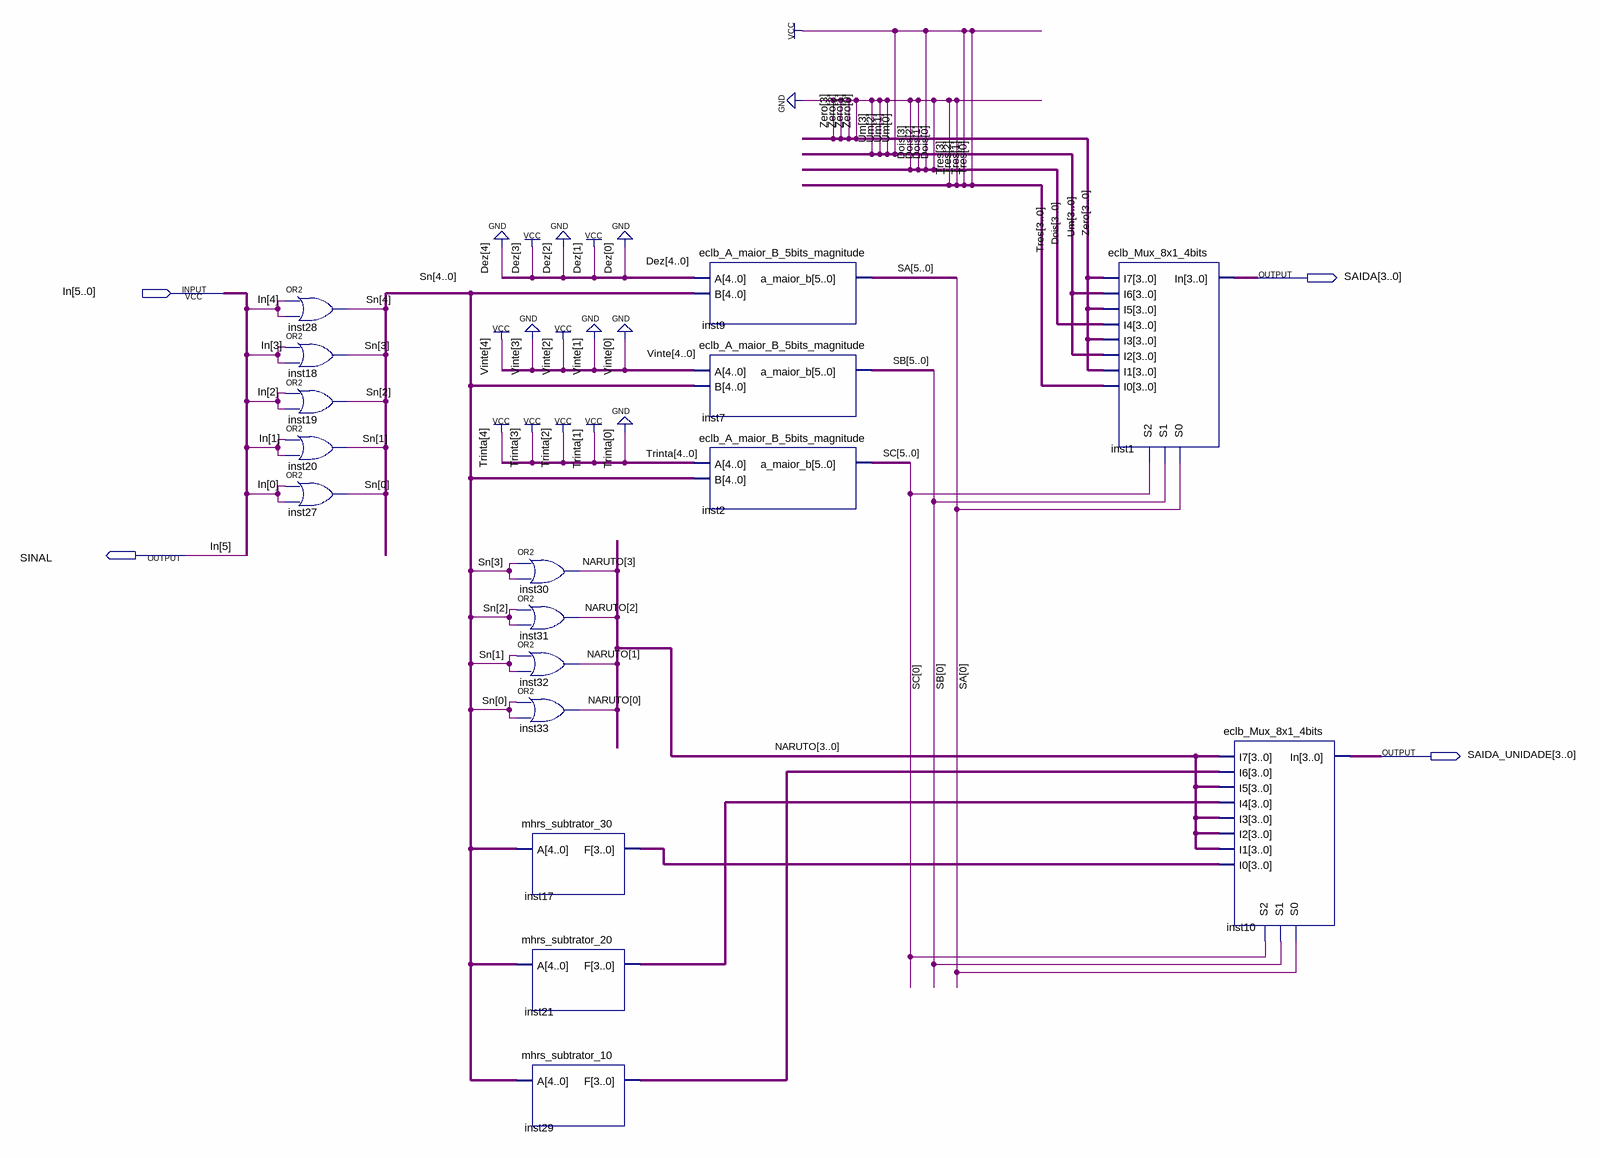
[diagram p0: schematic sheet]
// Quartus schematic Analisador_7seg.bdf as structural Verilog: 17 symbols, 4 pins
module Analisador_7seg (
  input  [5:0] In,
  output [3:0] SAIDA,
  output SINAL,
  output [3:0] SAIDA_UNIDADE
);

  wire [3:0] inst17_f, inst21_f, inst29_f, NARUTO;
  wire [4:0] Sn;
  wire [5:0] SA, SB, SC;

  or inst28 (Sn[4], In[4], In[4]);
  or inst18 (Sn[3], In[3], In[3]);
  or inst19 (Sn[2], In[2], In[2]);
  or inst20 (Sn[1], In[1], In[1]);
  or inst27 (Sn[0], In[0], In[0]);
  or inst30 (NARUTO[3], Sn[3], Sn[3]);
  or inst31 (NARUTO[2], Sn[2], Sn[2]);
  or inst32 (NARUTO[1], Sn[1], Sn[1]);
  or inst33 (NARUTO[0], Sn[0], Sn[0]);
  mhrs_subtrator_30 inst17 (.A(Sn), .F(inst17_f));
  mhrs_subtrator_20 inst21 (.A(Sn), .F(inst21_f));
  mhrs_subtrator_10 inst29 (.A(Sn), .F(inst29_f));
  eclb_A_maior_B_5bits_magnitude inst9 (.A(5'b01010), .B(Sn), .a_maior_b(SA));
  eclb_A_maior_B_5bits_magnitude inst7 (.A(5'b10100), .B(Sn), .a_maior_b(SB));
  eclb_A_maior_B_5bits_magnitude inst2 (.A(5'b11110), .B(Sn), .a_maior_b(SC));
  eclb_Mux_8x1_4bits inst1 (
    .I7(4'b0000), .I6(4'b0001), .I5(4'b0000), .I4(4'b0010), .I3(4'b0000), .I2(4'b0001), .I1(4'b0000),
    .I0(4'b0011), .S2(SC[0]), .S1(SB[0]), .S0(SA[0]), .In(SAIDA));
  eclb_Mux_8x1_4bits inst10 (
    .I7(NARUTO), .I6(inst29_f), .I5(NARUTO), .I4(inst21_f), .I3(NARUTO), .I2(NARUTO), .I1(NARUTO),
    .I0(inst17_f), .S2(SC[0]), .S1(SB[0]), .S0(SA[0]), .In(SAIDA_UNIDADE));

  assign SINAL = In[5];
endmodule
